# Altium schematic sheet CPCIS_EEM_Controller.SchDoc
size A4
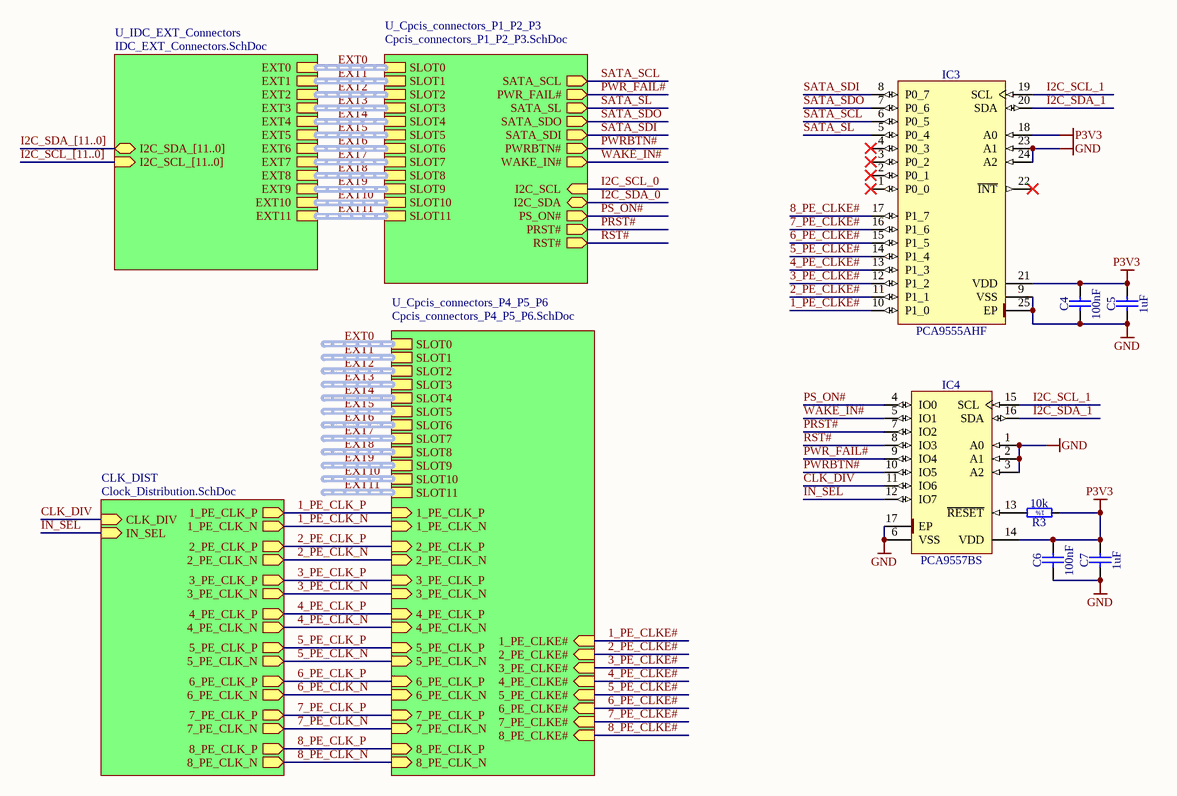
[diagram p0: CPCIS_EEM_Controller.SchDoc]

## Parts
C4  100nF  [CAPC0603X33N]
C5  1uF  [CAPC1608X87N]
C6  100nF  [CAPC0603X33N]
C7  1uF  [CAPC1608X87N]
IC3  PCA9555AHF  [QFN50P400X400X80-25N-S225]
IC4  PCA9557BS  [QFN65P400X400X100-17N-S225]
R3  10k  [RESC1005X40N]

## Sub-sheets
CLK_DIST = Clock_Distribution.SchDoc: 1_PE_CLK_P (out), 1_PE_CLK_N (out), 2_PE_CLK_P (out), 2_PE_CLK_N (out), 3_PE_CLK_P (out), 3_PE_CLK_N (out), 4_PE_CLK_P (out), 4_PE_CLK_N (out), 5_PE_CLK_P (out), 5_PE_CLK_N (out), 6_PE_CLK_P (out), 6_PE_CLK_N (out), 7_PE_CLK_P (out), 7_PE_CLK_N (out), 8_PE_CLK_P (out), 8_PE_CLK_N (out), CLK_DIV (in), IN_SEL (in)
U_Cpcis_connectors_P1_P2_P3 = Cpcis_connectors_P1_P2_P3.SchDoc: SLOT2 (harness ExtensionConnector), SLOT3 (harness ExtensionConnector), SLOT1 (harness ExtensionConnector), SLOT4 (harness ExtensionConnector), SLOT5 (harness ExtensionConnector), SLOT6 (harness ExtensionConnector), SLOT7 (harness ExtensionConnector), SLOT8 (harness ExtensionConnector), SATA_SCL (out), PWR_FAIL# (out), SATA_SL (out), SATA_SDO (out), SATA_SDI (out), PWRBTN# (out), WAKE_IN# (out), I2C_SCL (in), I2C_SDA (bidir), PS_ON# (out), PRST# (out), RST# (out), SLOT9 (harness ExtensionConnector), SLOT10 (harness ExtensionConnector), SLOT11 (harness ExtensionConnector), SLOT0 (harness ExtensionConnector)
U_Cpcis_connectors_P4_P5_P6 = Cpcis_connectors_P4_P5_P6.SchDoc: SLOT2 (harness ExtensionConnector), SLOT3 (harness ExtensionConnector), SLOT1 (harness ExtensionConnector), SLOT4 (harness ExtensionConnector), SLOT5 (harness ExtensionConnector), SLOT6 (harness ExtensionConnector), SLOT7 (harness ExtensionConnector), SLOT8 (harness ExtensionConnector), 1_PE_CLK_P (in), 1_PE_CLK_N (in), 2_PE_CLK_P (in), 2_PE_CLK_N (in), 3_PE_CLK_P (in), 3_PE_CLK_N (in), 4_PE_CLK_P (in), 4_PE_CLK_N (in), 5_PE_CLK_P (in), 5_PE_CLK_N (in), 6_PE_CLK_P (in), 6_PE_CLK_N (in), 7_PE_CLK_P (in), 7_PE_CLK_N (in), 8_PE_CLK_P (in), 8_PE_CLK_N (in), 3_PE_CLKE# (in), 6_PE_CLKE# (in), 1_PE_CLKE# (in), 5_PE_CLKE# (in), 7_PE_CLKE# (in), 4_PE_CLKE# (in), 8_PE_CLKE# (in), 2_PE_CLKE# (in), SLOT9 (harness ExtensionConnector), SLOT10 (harness ExtensionConnector), SLOT11 (harness ExtensionConnector), SLOT0 (harness ExtensionConnector)
U_IDC_EXT_Connectors = IDC_EXT_Connectors.SchDoc: EXT0 (harness ExtensionConnector), EXT2 (harness ExtensionConnector), EXT4 (harness ExtensionConnector), EXT5 (harness ExtensionConnector), EXT6 (harness ExtensionConnector), EXT7 (harness ExtensionConnector), I2C_SDA_[11..0] (bidir), I2C_SCL_[11..0] (in), EXT3 (harness ExtensionConnector), EXT1 (harness ExtensionConnector), EXT8 (harness ExtensionConnector), EXT9 (harness ExtensionConnector), EXT10 (harness ExtensionConnector), EXT11 (harness ExtensionConnector)

## Nets
GND: C4.1 C5.1 C6.1 C7.1 IC3.9(VSS) IC3.23(A1) IC3.24(A2) IC3.25(EP) IC4.1(A0) IC4.2(A1) IC4.3(A2) IC4.6(VSS) IC4.17(EP)
P3V3: C4.2 C5.2 C6.2 C7.2 IC3.18(A0) IC3.21(VDD) IC4.14(VDD) R3.1
1_PE_CLK_N: sheet U_Cpcis_connectors_P4_P5_P6/1_PE_CLK_N, sheet CLK_DIST/1_PE_CLK_N
1_PE_CLK_P: sheet U_Cpcis_connectors_P4_P5_P6/1_PE_CLK_P, sheet CLK_DIST/1_PE_CLK_P
1_PE_CLKE#: IC3.10(P1_0) ; sheet U_Cpcis_connectors_P4_P5_P6/1_PE_CLKE#
2_PE_CLK_N: sheet U_Cpcis_connectors_P4_P5_P6/2_PE_CLK_N, sheet CLK_DIST/2_PE_CLK_N
2_PE_CLK_P: sheet U_Cpcis_connectors_P4_P5_P6/2_PE_CLK_P, sheet CLK_DIST/2_PE_CLK_P
2_PE_CLKE#: IC3.11(P1_1) ; sheet U_Cpcis_connectors_P4_P5_P6/2_PE_CLKE#
3_PE_CLK_N: sheet U_Cpcis_connectors_P4_P5_P6/3_PE_CLK_N, sheet CLK_DIST/3_PE_CLK_N
3_PE_CLK_P: sheet U_Cpcis_connectors_P4_P5_P6/3_PE_CLK_P, sheet CLK_DIST/3_PE_CLK_P
3_PE_CLKE#: IC3.12(P1_2) ; sheet U_Cpcis_connectors_P4_P5_P6/3_PE_CLKE#
4_PE_CLK_N: sheet U_Cpcis_connectors_P4_P5_P6/4_PE_CLK_N, sheet CLK_DIST/4_PE_CLK_N
4_PE_CLK_P: sheet U_Cpcis_connectors_P4_P5_P6/4_PE_CLK_P, sheet CLK_DIST/4_PE_CLK_P
4_PE_CLKE#: IC3.13(P1_3) ; sheet U_Cpcis_connectors_P4_P5_P6/4_PE_CLKE#
5_PE_CLK_N: sheet U_Cpcis_connectors_P4_P5_P6/5_PE_CLK_N, sheet CLK_DIST/5_PE_CLK_N
5_PE_CLK_P: sheet U_Cpcis_connectors_P4_P5_P6/5_PE_CLK_P, sheet CLK_DIST/5_PE_CLK_P
5_PE_CLKE#: IC3.14(P1_4) ; sheet U_Cpcis_connectors_P4_P5_P6/5_PE_CLKE#
6_PE_CLK_N: sheet U_Cpcis_connectors_P4_P5_P6/6_PE_CLK_N, sheet CLK_DIST/6_PE_CLK_N
6_PE_CLK_P: sheet U_Cpcis_connectors_P4_P5_P6/6_PE_CLK_P, sheet CLK_DIST/6_PE_CLK_P
6_PE_CLKE#: IC3.15(P1_5) ; sheet U_Cpcis_connectors_P4_P5_P6/6_PE_CLKE#
7_PE_CLK_N: sheet U_Cpcis_connectors_P4_P5_P6/7_PE_CLK_N, sheet CLK_DIST/7_PE_CLK_N
7_PE_CLK_P: sheet U_Cpcis_connectors_P4_P5_P6/7_PE_CLK_P, sheet CLK_DIST/7_PE_CLK_P
7_PE_CLKE#: IC3.16(P1_6) ; sheet U_Cpcis_connectors_P4_P5_P6/7_PE_CLKE#
8_PE_CLK_N: sheet U_Cpcis_connectors_P4_P5_P6/8_PE_CLK_N, sheet CLK_DIST/8_PE_CLK_N
8_PE_CLK_P: sheet U_Cpcis_connectors_P4_P5_P6/8_PE_CLK_P, sheet CLK_DIST/8_PE_CLK_P
8_PE_CLKE#: IC3.17(P1_7) ; sheet U_Cpcis_connectors_P4_P5_P6/8_PE_CLKE#
CLK_DIV: IC4.11(IO6) ; sheet CLK_DIST/CLK_DIV
I2C_SCL_0: sheet U_Cpcis_connectors_P1_P2_P3/I2C_SCL
I2C_SCL_1: IC3.19(SCL) IC4.15(SCL)
I2C_SDA_0: sheet U_Cpcis_connectors_P1_P2_P3/I2C_SDA
I2C_SDA_1: IC3.20(SDA) IC4.16(SDA)
IN_SEL: IC4.12(IO7) ; sheet CLK_DIST/IN_SEL
PRST#: IC4.7(IO2) ; sheet U_Cpcis_connectors_P1_P2_P3/PRST#
PS_ON#: IC4.4(IO0) ; sheet U_Cpcis_connectors_P1_P2_P3/PS_ON#
PWR_FAIL#: IC4.9(IO4) ; sheet U_Cpcis_connectors_P1_P2_P3/PWR_FAIL#
PWRBTN#: IC4.10(IO5) ; sheet U_Cpcis_connectors_P1_P2_P3/PWRBTN#
RST#: IC4.8(IO3) ; sheet U_Cpcis_connectors_P1_P2_P3/RST#
SATA_SCL: IC3.6(P0_5) ; sheet U_Cpcis_connectors_P1_P2_P3/SATA_SCL
SATA_SDI: IC3.8(P0_7) ; sheet U_Cpcis_connectors_P1_P2_P3/SATA_SDI
SATA_SDO: IC3.7(P0_6) ; sheet U_Cpcis_connectors_P1_P2_P3/SATA_SDO
SATA_SL: IC3.5(P0_4) ; sheet U_Cpcis_connectors_P1_P2_P3/SATA_SL
WAKE_IN#: IC4.5(IO1) ; sheet U_Cpcis_connectors_P1_P2_P3/WAKE_IN#
NetIC4_13: IC4.13(~{RESET}) R3.2

Not connected (* = marked no-connect by the designer): IC3 1(P0_0)* 2(P0_1)* 3(P0_2)* 4(P0_3)* 22(~{INT})*

## Buses and harness runs
bus I2C_SCL_[11..0] = sheet U_IDC_EXT_Connectors/I2C_SCL_[11..0]
bus I2C_SDA_[11..0] = sheet U_IDC_EXT_Connectors/I2C_SDA_[11..0]
harness EXT0 = sheet U_Cpcis_connectors_P1_P2_P3/SLOT0 = sheet U_IDC_EXT_Connectors/EXT0
harness EXT0 = sheet U_Cpcis_connectors_P4_P5_P6/SLOT0
harness EXT1 = sheet U_Cpcis_connectors_P1_P2_P3/SLOT1 = sheet U_IDC_EXT_Connectors/EXT1
harness EXT1 = sheet U_Cpcis_connectors_P4_P5_P6/SLOT1
harness EXT2 = sheet U_Cpcis_connectors_P1_P2_P3/SLOT2 = sheet U_IDC_EXT_Connectors/EXT2
harness EXT2 = sheet U_Cpcis_connectors_P4_P5_P6/SLOT2
harness EXT3 = sheet U_Cpcis_connectors_P1_P2_P3/SLOT3 = sheet U_IDC_EXT_Connectors/EXT3
harness EXT3 = sheet U_Cpcis_connectors_P4_P5_P6/SLOT3
harness EXT4 = sheet U_Cpcis_connectors_P1_P2_P3/SLOT4 = sheet U_IDC_EXT_Connectors/EXT4
harness EXT4 = sheet U_Cpcis_connectors_P4_P5_P6/SLOT4
harness EXT5 = sheet U_Cpcis_connectors_P1_P2_P3/SLOT5 = sheet U_IDC_EXT_Connectors/EXT5
harness EXT5 = sheet U_Cpcis_connectors_P4_P5_P6/SLOT5
harness EXT6 = sheet U_Cpcis_connectors_P1_P2_P3/SLOT6 = sheet U_IDC_EXT_Connectors/EXT6
harness EXT6 = sheet U_Cpcis_connectors_P4_P5_P6/SLOT6
harness EXT7 = sheet U_Cpcis_connectors_P1_P2_P3/SLOT7 = sheet U_IDC_EXT_Connectors/EXT7
harness EXT7 = sheet U_Cpcis_connectors_P4_P5_P6/SLOT7
harness EXT8 = sheet U_Cpcis_connectors_P1_P2_P3/SLOT8 = sheet U_IDC_EXT_Connectors/EXT8
harness EXT8 = sheet U_Cpcis_connectors_P4_P5_P6/SLOT8
harness EXT9 = sheet U_Cpcis_connectors_P1_P2_P3/SLOT9 = sheet U_IDC_EXT_Connectors/EXT9
harness EXT9 = sheet U_Cpcis_connectors_P4_P5_P6/SLOT9
harness EXT10 = sheet U_Cpcis_connectors_P1_P2_P3/SLOT10 = sheet U_IDC_EXT_Connectors/EXT10
harness EXT10 = sheet U_Cpcis_connectors_P4_P5_P6/SLOT10
harness EXT11 = sheet U_Cpcis_connectors_P1_P2_P3/SLOT11 = sheet U_IDC_EXT_Connectors/EXT11
harness EXT11 = sheet U_Cpcis_connectors_P4_P5_P6/SLOT11

## Notes on the sheet
- (in symbol R0402_10K_1%_0.0625W_100PPM) 1%

## Library data of the parts
C4 C6 = CC0201_100NF_6.3V_10%_X5R: Non-polarised capacitor; Part Description: SMD Multilayer Chip Ceramic Capacitor; Manufacturer: GENERIC; Manufacturer1 Part Number: 02016D104KAT2A; Voltage: 6.3V; TC: X5R; Tolerance: ±10%; Part Number: CC0201_100NF_6.3V_10%_X5R; Component Kind: Standard; Component Type: Standard; Pin Count: 2; Value: 100nF; Status: Not Recommended; Manufacturer Part Number: CC0201_100NF_6.3V_10%_X5R; Case: 0201; Mounted: Yes; Socket: No; SMD: Yes; Sense: No; Manufacturer1 Example: AVX; Manufacturer1 ComponentHeight: 0.33mm; HelpURL: \\cern.ch\dfs\Applications\Altium\Datasheets\CC0201_X5R_AVX.pdf; Author: CERN DEM JLC; CreateDate: 03.12.2007; LatestRevisionDate: 03.12.2007
C5 C7 = CC0603_1UF_25V_10%_X7R: Non-polarised capacitor; Part Description: SMD Multilayer Chip Ceramic Capacitor; Manufacturer: GENERIC; Manufacturer1 Part Number: GRM188R71E105KA12D; Voltage: 25V; TC: X7R; Tolerance: ±10%; Part Number: CC0603_1UF_25V_10%_X7R; Component Kind: Standard; Component Type: Standard; Pin Count: 2; Value: 1uF; Status: None; Manufacturer Part Number: CC0603_1UF_25V_10%_X7R; Case: 0603; Mounted: Yes; Socket: No; SMD: Yes; Sense: No; Manufacturer1 Example: MURATA; Manufacturer1 ComponentHeight: 0.9mm; HelpURL: \\cern.ch\dfs\Applications\Altium\Datasheets\CC0603_X7R_MURATA.pdf; Author: CERN DEM JLC; CreateDate: 18.01.2011; LatestRevisionDate: 18.01.2011
IC3 = PCA9555AHF: Low-Voltage 16-Bit I2C-bus I/O Port With Interrupt and Weak Pull-Up; Manufacturer: NXP SEMICONDUCTORS; PressFit: No; Bonding: No; Part Number: PCA9555AHF; Component Kind: Standard; Component Type: Standard; Device: PCA9555AHF; PackageDescription: QFN, 0.50mm Pitch, Square; 24 Pin, 4.00mm L X 4.00mm W X 0.80mm H body (w/Thermal Tab 2.25 X 2.25mm), IPC Medium Density; Part Description: Low-Voltage 16-Bit I2C-bus I/O Port With Interrupt and Weak Pull-Up; Manufacturer Part Number: PCA9555AHF; Pin Count: 25; Case: QFN24; Mounted: Yes; Socket: No; SMD: Yes; Sense: No; ComponentHeight: 0.8mm; Author: CERN DEM BC; HelpURL: \\cern.ch\dfs\Applications\Altium\Datasheets\PCA9555AHF.pdf; CreateDate: 24.07.2015; LatestRevisionDate: 24.07.2015
IC4 = PCA9557BS: 8-Bit I2C-bus and SMBus I/O Port with Reset; Manufacturer: NXP SEMICONDUCTORS; PressFit: No; Bonding: No; Part Number: PCA9557BS; Component Kind: Standard; Component Type: Standard; Device: PCA9557BS; PackageDescription: QFN, 0.65mm Pitch, Square; 16 Pin, 4.00mm L X 4.00mm W X 1.00mm H body (w/Thermal Tab 2.25 X 2.25mm), IPC Medium Density; Part Description: 8-Bit I2C-bus and SMBus I/O Port with Reset; Manufacturer Part Number: PCA9557BS; Pin Count: 17; Case: QFN16; Mounted: Yes; Socket: No; SMD: Yes; Sense: No; ComponentHeight: 1mm; Author: CERN DEM JMW; HelpURL: \\cern.ch\dfs\Applications\Altium\Datasheets\PCA9557BS.pdf; CreateDate: 22.09.2015; LatestRevisionDate: 22.09.2015
R3 = R0402_10K_1%_0.0625W_100PPM: Resistor - 1%; Part Description: General Purpose Thick Film Chip Resistor; Manufacturer: GENERIC; Manufacturer1 Part Number: 232270671003L; TC: ±100ppm/°C; Part Number: R0402_10K_1%_0.0625W_100PPM; Component Kind: Standard; Component Type: Standard; Pin Count: 2; Value: 10k; Status: Not recommended; Power: 0.0625W; Tolerance: ±1%; Manufacturer Part Number: R0402_10K_1%_0.0625W_100PPM; Case: 0402; Mounted: Yes; Sense: No; Socket: No; SMD: Yes; Manufacturer1 Example: YAGEO PHYCOMP; Manufacturer1 ComponentHeight: 0.4mm; HelpURL: \\cern.ch\dfs\Applications\Altium\Datasheets\R0402_Phycomp_RC0402.pdf; Author: CERN DEM JLC; CreateDate: 03.12.2007; LatestRevisionDate: 17.10.2012